# Altium schematic sheet FanControl.SchDoc
size A4
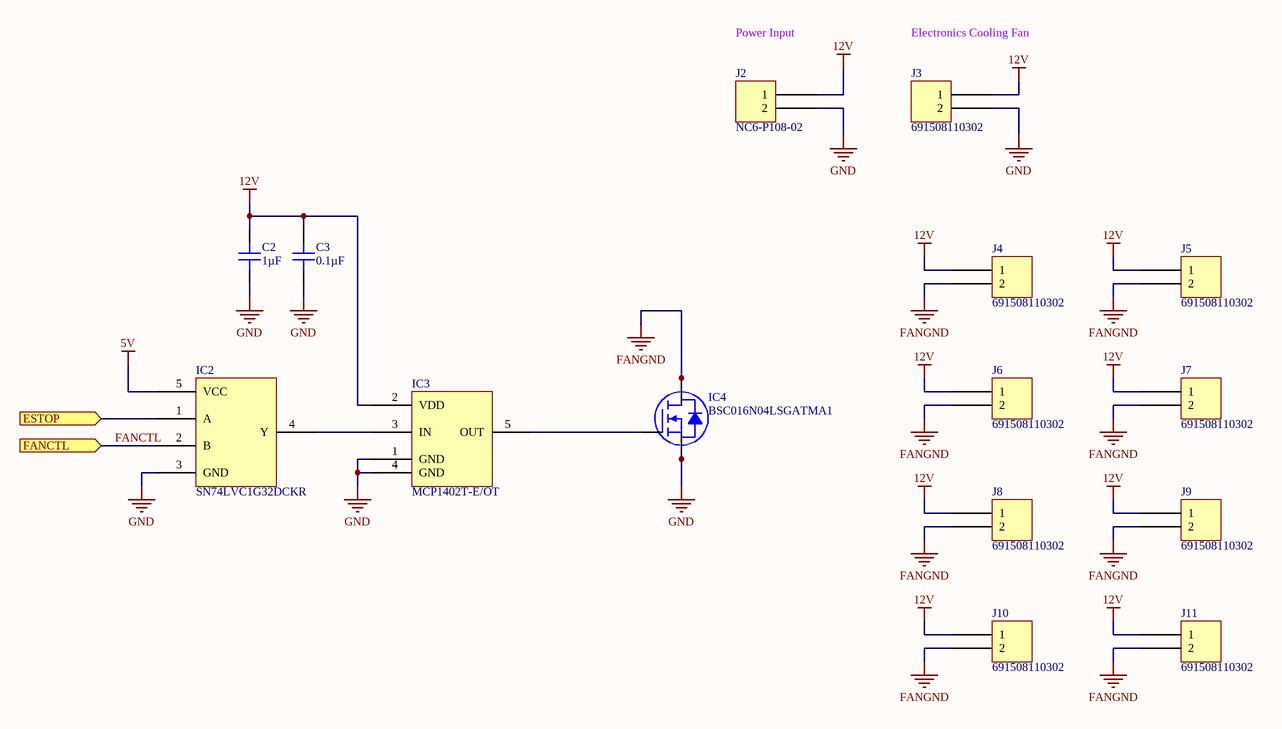
[diagram p0: FanControl.SchDoc]

## Parts
C2  1µF  [CAP 0603_1608]
C3  0.1µF  [CAP 0603_1608]
IC2  SN74LVC1G32DCKR  [TI SC70-6 DCK]
IC3  MCP1402T-E/OT  [MICROCHIP SOT-23-5 OT]
IC4  BSC016N04LSGATMA1  [INFINEON PG-TDSON-8]
J2  NC6-P108-02  [TE NC6-P108-02]
J3  691508110302  [WURTH 691508110302]
J4  691508110302  [WURTH 691508110302]
J5  691508110302  [WURTH 691508110302]
J6  691508110302  [WURTH 691508110302]
J7  691508110302  [WURTH 691508110302]
J8  691508110302  [WURTH 691508110302]
J9  691508110302  [WURTH 691508110302]
J10  691508110302  [WURTH 691508110302]
J11  691508110302  [WURTH 691508110302]

## Ports
ESTOP (in), FANCTL (in)

## Nets
5V: IC2.5(VCC)
12V: C2.2 C3.2 IC3.2(VDD) J2.1 J3.1 J4.1 J5.1 J6.1 J7.1 J8.1 J9.1 J10.1 J11.1
FANGND: IC4.5(D) IC4.6(D) IC4.7(D) IC4.8(D) J4.2 J5.2 J6.2 J7.2 J8.2 J9.2 J10.2 J11.2
GND: C2.1 C3.1 IC2.3(GND) IC3.1(GND) IC3.4(GND) IC4.1(S) IC4.2(S) IC4.3(S) J2.2 J3.2
ESTOP: IC2.1(A) ; port ESTOP
FANCTL: IC2.2(B) ; port FANCTL
NetIC2_4: IC2.4(Y) IC3.3(IN)
NetIC3_5: IC3.5(OUT) IC4.4(G)

## Notes on the sheet
- Power Input
- Electronics Cooling Fan
- Title
- Size:
- Date:
- A4
- Number:
- Time:
- Revision:
- Sheet
- of
- File:

## Library data of the parts
C2 = CC0603KRX5R8BB105: CAP CER 1UF 25V X5R 0603; Manufacturer: Yageo; Tolerance: ±10%; Part Number: CC0603KRX5R8BB105; Value: 1µF; Applications: General Purpose; Capacitance: 1µF; ComponentLink1Description: Datasheet; ComponentLink1URL: https://www.yageo.com/upload/media/product/productsearch/datasheet/mlcc/UPY-GPHC_X5R_4V-to-50V_25.pdf; ComponentLink2Description: DigiKey Link; ComponentLink2URL: http://digikey.com/product-detail/en/yageo/CC0603KRX5R8BB105/311-1445-1-ND/2833751; Device Package: 0603 (1608 Metric); LastUpdated: 21/01/2020 00:02:05; Lifecycle Status: Active; Minimum Order: 1; Mounting Type: Surface Mount, MLCC; Operating Temperature: -55°C ~ 85°C; Package / Case: 0603 (1608 Metric); Packaging: TapeAndReel; PartId: 5146; Part Status: Active; Price: 0.01; Series: CC; Size / Dimension: 0.063" L x 0.031" W (1.60mm x 0.80mm); Supplier 1: DigiKey; Supplier Part Number 1: 311-1445-1-ND; Temperature Coefficient: X5R; Thickness (Max): 0.035" (0.90mm); Voltage - Rated: 25V
C3 = 06035C104JAT4A: CAP CER 0.1UF 50V X7R 0603; Manufacturer: AVX Corporation; Tolerance: ±5%; Part Number: 06035C104JAT4A; Value: 0.1µF; Applications: General Purpose; Capacitance: 0.1µF; ComponentLink1Description: Datasheet; ComponentLink1URL: http://datasheets.avx.com/X7RDielectric.pdf; ComponentLink2Description: DigiKey Link; ComponentLink2URL: http://digikey.com/product-detail/en/avx-corporation/06035C104JAT4A/478-12459-1-ND/9749311; Device Package: 0603 (1608 Metric); LastUpdated: 21/01/2020 00:02:08; Lifecycle Status: Active; Minimum Order: 1; Mounting Type: Surface Mount, MLCC; Operating Temperature: -55°C ~ 125°C; Package / Case: 0603 (1608 Metric); Packaging: TapeAndReel; PartId: 3002; Part Status: Active; Price: 0.01; Series: -; Size / Dimension: 0.063" L x 0.032" W (1.60mm x 0.81mm); Supplier 1: DigiKey; Supplier Part Number 1: 478-12459-1-ND; Temperature Coefficient: X7R; Thickness (Max): 0.035" (0.90mm); Voltage - Rated: 50V
IC2 = SN74LVC1G32DCKR: IC GATE OR 1CH 2-INP SC70-5; Manufacturer: Texas Instruments; Current - Output High, Low: 32mA, 32mA; Current - Quiescent (Max): 10µA; Logic Level - High: 1.7V ~ 2V; Logic Level - Low: 0.7V ~ 0.8V; Logic Type: OR Gate; Max Propagation Delay @ V, Max CL: 4ns @ 5V, 50pF; Number of Circuits: 1; Number of Inputs: 2; Voltage - Supply: 1.65V ~ 5.5V; Part Number: SN74LVC1G32DCKR; ComponentLink1Description: Datasheet; ComponentLink1URL: http://www.ti.com/general/docs/suppproductinfo.tsp?distId=10&gotoUrl=http%3A%2F%2Fwww.ti.com%2Flit%2Fgpn%2Fsn74lvc1g32; ComponentLink2Description: DigiKey Link; ComponentLink2URL: http://digikey.com/product-detail/en/texas-instruments/SN74LVC1G32DCKR/296-9848-1-ND/380106; Device Package: 5-TSSOP, SC-70-5, SOT-353; LastUpdated: 31/01/2020 03:20:00; Lifecycle Status: Active; Minimum Order: 1; Mounting Type: Surface Mount; Operating Temperature: -40°C ~ 125°C; Package / Case: 5-TSSOP, SC-70-5, SOT-353; Packaging: TapeAndReel; PartId: 3; Part Status: Active; Price: 0.05; Series: 74LVC; Supplier 1: DigiKey; Supplier Part Number 1: 296-9848-1-ND; Supplier Device Package: SC-70-5
IC3 = MCP1402T-E/OT: IC GATE DRVR LOW-SIDE SOT23-5; Manufacturer: Microchip Technology; Channel Type: Single; Current - Peak Output (Source, Sink): 500mA, 500mA; Gate Type: IGBT, N-Channel, P-Channel MOSFET; Input Type: Non-Inverting; Logic Voltage - VIL, VIH: 0.8V, 2.4V; Number of Drivers: 1; Rise / Fall Time (Typ): 19ns, 15ns; Voltage - Supply: 4.5V ~ 18V; Part Number: MCP1402T-E/OT; ComponentLink1Description: Datasheet; ComponentLink1URL: http://www.microchip.com/mymicrochip/filehandler.aspx?ddocname=en530890; ComponentLink2Description: DigiKey Link; ComponentLink2URL: http://digikey.com/product-detail/en/microchip-technology/MCP1402T-E-OT/MCP1402T-E-OTCT-ND/1956554; Device Package: SC-74A, SOT-753; Driven Configuration: Low-Side; LastUpdated: 31/01/2020 01:34:33; Lifecycle Status: Active; Minimum Order: 1; Mounting Type: Surface Mount; Operating Temperature: -40°C ~ 150°C (TJ); Package / Case: SC-74A, SOT-753; Packaging: TapeAndReel; PartId: 10; Part Status: Active; Price: 0.47; Series: -; Supplier 1: DigiKey; Supplier Part Number 1: MCP1402T-E/OTCT-ND; Supplier Device Package: SOT-23-5
IC4 = BSC016N04LSGATMA1: MOSFET N-CH 40V 100A TDSON-8; Manufacturer: Infineon Technologies; Current - Continuous Drain (Id) @ 25°C: 31A (Ta), 100A (Tc); Drive Voltage (Max Rds On,  Min Rds On): 4.5V, 10V; FET Type: N-Channel; Gate Charge (Qg) (Max) @ Vgs: 150nC @ 10V; Input Capacitance (Ciss) (Max) @ Vds: 12000pF @ 20V; Power Dissipation (Max): 2.5W (Ta), 139W (Tc); Rds On (Max) @ Id, Vgs: 1.6mOhm @ 50A, 10V; Vgs (Max): ±20V; Vgs(th) (Max) @ Id: 2V @ 85µA; Part Number: BSC016N04LSGATMA1; ComponentLink1Description: Datasheet; ComponentLink1URL: https://www.infineon.com/dgdl/BSC016N04LSG_rev1.6.pdf?folderId=db3a304313b8b5a60113cee8763b02d7&fileId=db3a304318a6cd680118efe284830226; ComponentLink2Description: DigiKey Link; ComponentLink2URL: http://digikey.com/product-detail/en/infineon-technologies/BSC016N04LSGATMA1/BSC016N04LSGATMA1CT-ND/2231025; Device Package: 8-PowerTDFN; Drain to Source Voltage (Vdss): 40V; LastUpdated: 21/01/2020 03:59:50; Lifecycle Status: Active; Minimum Order: 1; Mounting Type: Surface Mount; Operating Temperature: -55°C ~ 150°C (TJ); Package / Case: 8-PowerTDFN; Packaging: TapeAndReel; Part Status: Active; Price: 0.95; Series: OptiMOS™; Supplier 1: DigiKey; Supplier Part Number 1: BSC016N04LSGATMA1CT-ND; Supplier Device Package: PG-TDSON-8-1; Technology: MOSFET (Metal Oxide)
J2 = NC6-P108-02: CONN BARRIER STRIP 2CIRC 0.375"; Manufacturer: TE Connectivity AMP Connectors; Barrier Type: 2 Wall (Dual); Bottom Termination: PC Pin; Current Rating (Amps): 20A; Number of Circuits: 2; Pitch: 0.375" (9.53mm); Top Termination: Screws with Captive Plate; Voltage Rating: 300V; Wire Gauge: 12-22 AWG; Part Number: NC6-P108-02; Color: Black; ComponentLink1Description: Datasheet; ComponentLink1URL: https://www.te.com/commerce/DocumentDelivery/DDEController?Action=srchrtrv&DocNm=3-1437664-0&DocType=Customer+Drawing&DocLang=English; ComponentLink2Description: DigiKey Link; ComponentLink2URL: http://digikey.com/product-detail/en/te-connectivity-amp-connectors/NC6-P108-02/A98495-ND/1277926; LastUpdated: 15/01/2020 04:11:24; Lifecycle Status: Active; Minimum Order: 1; Number of Rows: 1; Number of Wire Entries: 2; Packaging: Bulk; Part Status: Active; Price: 1.56; Series: NC6, Buchanan; Supplier 1: DigiKey; Supplier Part Number 1: A98495-ND; Terminal Block Type: Barrier Block
J3-J11 = 691508110302: TERM BLOCK 2POS 3.5MM SMD; Manufacturer: Würth Elektronik; Current: 10A; Mating Orientation: Horizontal and Vertical with Board; Number of Levels: 1; Pitch: 0.138" (3.50mm); Positions Per Level: 2; Voltage: 300V; Wire Gauge: 16-30 AWG; Wire Termination: Screw - Rising Cage Clamp; Part Number: 691508110302; Color: Black; ComponentLink1Description: Datasheet; ComponentLink1URL: https://katalog.we-online.de/em/datasheet/6915081103xx.pdf; ComponentLink2Description: DigiKey Link; ComponentLink2URL: http://digikey.com/product-detail/en/w-rth-elektronik/691508110302/732-5963-1-ND/5047612; Features: Board Guide, Mounting Flange; LastUpdated: 15/01/2020 04:18:55; Lifecycle Status: Active; Minimum Order: 1; Mounting Type: Surface Mount; Packaging: TapeAndReel; Part Status: Active; Price: 1.57; Series: WR-TBL Series 5081; Supplier 1: DigiKey; Supplier Part Number 1: 732-5963-1-ND